# Altium schematic sheet Busswitch_B.SchDoc
size A4; CompanyName: Technische Hochschule Nürnberg Georg Simon Ohm; Organization: UltraZohm; Address1: Kesslerplatz 12; Address2: 90489 Nürnberg; Address3: GERMANY; DocumentNumber: 12; SheetNumber: 12; SheetTotal: 12; Website: www.ultrazohm.com
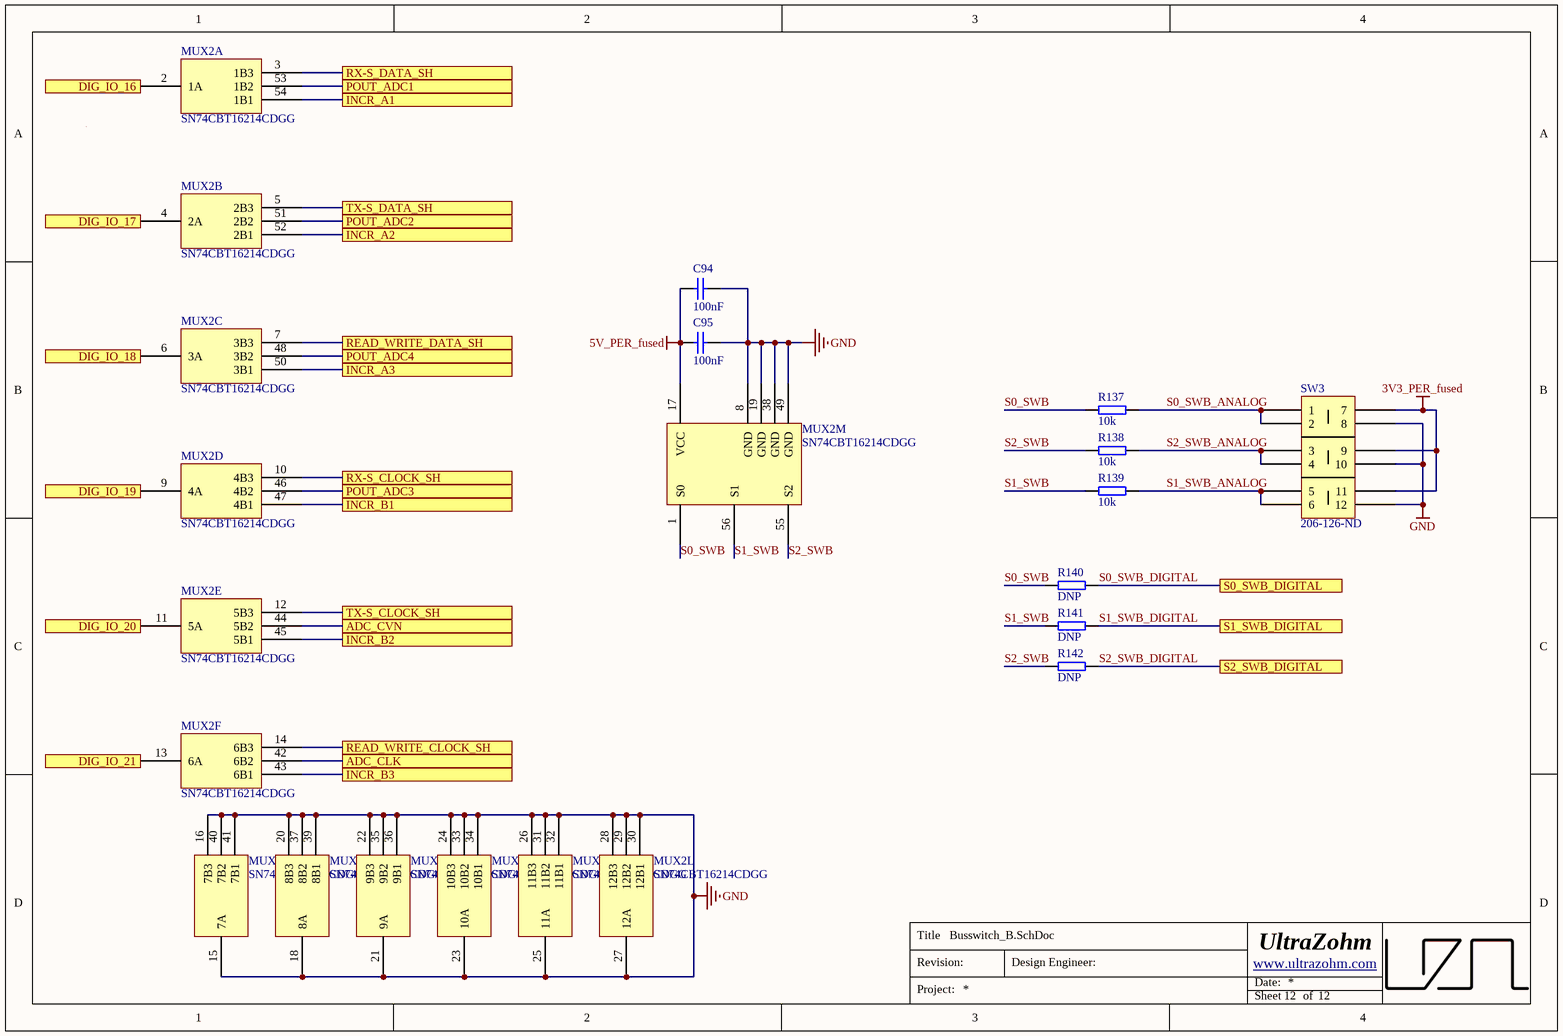
[diagram p0: Busswitch_B.SchDoc]

## Parts
C94  100nF  [CAPC1608X07N]
C95  100nF  [CAPC1608X07N]
MUX2  SN74CBT16214CDGG  [TSSOP50P810X120-56N]  (parts A,B,C,D,E,F,G,H,I,J,K,L,M of 13)
R137  10k  [RESC1608X06N]
R138  10k  [RESC1608X06N]
R139  10k  [RESC1608X06N]
R140  DNP  [RESC1608X06N]
R141  DNP  [RESC1608X06N]
R142  DNP  [RESC1608X06N]
SW3  Supplier Part Number 1: 206-126-ND  [206-123]  (hidden comment: 206-126)

## Ports
ADC_CLK, ADC_CVN, DIG_IO_16, DIG_IO_17, DIG_IO_18, DIG_IO_19, DIG_IO_20, DIG_IO_21, INCR_A1, INCR_A2, INCR_A3, INCR_B1, INCR_B2, INCR_B3, POUT_ADC1, POUT_ADC2, POUT_ADC3, POUT_ADC4, READ_WRITE_CLOCK_SH, READ_WRITE_DATA_SH, RX-S_CLOCK_SH, RX-S_DATA_SH, S0_SWB_DIGITAL, S1_SWB_DIGITAL, S2_SWB_DIGITAL, TX-S_CLOCK_SH, TX-S_DATA_SH

## Nets
3V3_PER_fused: SW3.7 SW3.9 SW3.11
5V_PER_fused: C94.1 C95.1 MUX2.17(VCC)
GND: C94.2 C95.2 MUX2.8(GND) MUX2.15(7A) MUX2.16(7B3) MUX2.18(8A) MUX2.19(GND) MUX2.20(8B3) MUX2.21(9A) MUX2.22(9B3) MUX2.23(10A) MUX2.24(10B3) MUX2.25(11A) MUX2.26(11B3) MUX2.27(12A) MUX2.28(12B3) MUX2.29(12B2) MUX2.30(12B1) MUX2.31(11B2) MUX2.32(11B1) MUX2.33(10B2) MUX2.34(10B1) MUX2.35(9B2) MUX2.36(9B1) MUX2.37(8B2) MUX2.38(GND) MUX2.39(8B1) MUX2.40(7B2) MUX2.41(7B1) MUX2.49(GND) SW3.8 SW3.10 SW3.12
ADC_CLK: MUX2.42(6B2) ; port ADC_CLK
ADC_CVN: MUX2.44(5B2) ; port ADC_CVN
DIG_IO_16: MUX2.2(1A) ; port DIG_IO_16
DIG_IO_17: MUX2.4(2A) ; port DIG_IO_17
DIG_IO_18: MUX2.6(3A) ; port DIG_IO_18
DIG_IO_19: MUX2.9(4A) ; port DIG_IO_19
DIG_IO_20: MUX2.11(5A) ; port DIG_IO_20
DIG_IO_21: MUX2.13(6A) ; port DIG_IO_21
INCR_A1: MUX2.54(1B1) ; port INCR_A1
INCR_A2: MUX2.52(2B1) ; port INCR_A2
INCR_A3: MUX2.50(3B1) ; port INCR_A3
INCR_B1: MUX2.47(4B1) ; port INCR_B1
INCR_B2: MUX2.45(5B1) ; port INCR_B2
INCR_B3: MUX2.43(6B1) ; port INCR_B3
POUT_ADC1: MUX2.53(1B2) ; port POUT_ADC1
POUT_ADC2: MUX2.51(2B2) ; port POUT_ADC2
POUT_ADC3: MUX2.46(4B2) ; port POUT_ADC3
POUT_ADC4: MUX2.48(3B2) ; port POUT_ADC4
READ_WRITE_CLOCK_SH: MUX2.14(6B3) ; port READ_WRITE_CLOCK_SH
READ_WRITE_DATA_SH: MUX2.7(3B3) ; port READ_WRITE_DATA_SH
RX-S_CLOCK_SH: MUX2.10(4B3) ; port RX-S_CLOCK_SH
RX-S_DATA_SH: MUX2.3(1B3) ; port RX-S_DATA_SH
S0_SWB: MUX2.1(S0) R137.2 R140.2
S0_SWB_ANALOG: R137.1 SW3.1 SW3.2
S0_SWB_DIGITAL: R140.1 ; port S0_SWB_DIGITAL
S1_SWB: MUX2.56(S1) R139.2 R141.2
S1_SWB_ANALOG: R139.1 SW3.5 SW3.6
S1_SWB_DIGITAL: R141.1 ; port S1_SWB_DIGITAL
S2_SWB: MUX2.55(S2) R138.2 R142.2
S2_SWB_ANALOG: R138.1 SW3.3 SW3.4
S2_SWB_DIGITAL: R142.1 ; port S2_SWB_DIGITAL
TX-S_CLOCK_SH: MUX2.12(5B3) ; port TX-S_CLOCK_SH
TX-S_DATA_SH: MUX2.5(2B3) ; port TX-S_DATA_SH

## Notes on the sheet
- Title
- Revision:
- Design Engineer:
- Date:
- Project:
- Sheet
- of

## Library data of the parts
C94 C95 = Cap_0603: MPN: 885012206071; MF: Würth; Voltage: 25V; Value: 100nF; Supplier 1: Mouser; Supplier 2: *; Supplier Part Number 1: 710-885012206071; Supplier Part Number 2: *
MUX2 = SN74CBT16214CDGG: Multiplexer/Demultiplexer Bus Switch 1-Element CMOS 36-IN 56-Pin TSSOP Tube; Manufacturer: Texas Instruments; Supplier 1: Arrow Electronics; Manufacturer Part Number: SN74CBT16214CDGG; RoHS: Yes; Case/Package: TSSOP; RoHS Compliant: Yes; Supplier Part Number 1: SN74CBT16214CDGG
R137-R142 = R_0603: MPN: CRCW06030000Z0EAC; MF: Vishay; Supplier 1: Mouser; Supplier Part Number 1: 71-CRCW06030000Z0EAC
  R137-R139: Value: 10k
  R140-R142: Value: DNP
SW3 = 206-126: Switch DIP OFF ON SPDT 6 Raised Slide 0.05A 24VDC PC Pins 2.54mm Thru-Hole Tube; Manufacturer: CTS; Body Material: Plastic; Voltage Rating (DC): 24V; Number of Positions: 6; Current Rating: 50mA; Electrical Life: 10000Cycles; Actuator Type: Slide (Standard); Pitch: 0.1inch; Washable: No; Supplier 1: Digi-Key; Manufacturer Part Number: 206-126; RoHS: Yes; Category: DIP Switches; Pricing 1: 1005=1,10898 (USD); Mount: Through Hole; Contact Plating: Gold; Min Operating Temperature: -55°C; Max Operating Temperature: 85°C; Packaging: Rail/Tube; Termination: PC Pin; Package Quantity: 15; Throw Configuration: SPDT; Series: 206; Max Voltage Rating (DC): 24V; Length: 1.286inch; Terminal Pitch: 2.54mm; Radiation Hardening: No; RoHS Compliant: Yes; ComponentLink1URL: https://datasheet.ciiva.com/8677/206-208-8677008.pdf?src-supplier=Avnet; ComponentLink1Description: https://datasheet.ciiva.com/8677/206-208-8677008.pdf?src-supplier=Avnet; ComponentLink2URL: https://datasheet.ciiva.com/12451/206-208-11732-12451385.pdf?src-supplier=Mouser; ComponentLink2Description: https://datasheet.ciiva.com/12451/206-208-11732-12451385.pdf?src-supplier=Mouser